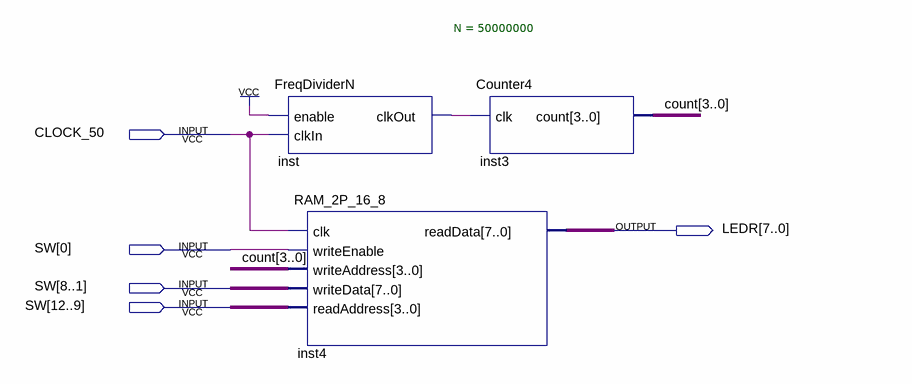
[diagram p0: schematic sheet]
// Quartus schematic RAM_2P_Demo.bdf as structural Verilog: 3 symbols, 5 pins
module RAM_2P_Demo (
  input  CLOCK_50,
  input  [12:0] SW,
  output [7:0] LEDR
);

  wire inst_clkout;
  wire [3:0] count;

  FreqDividerN #(.N(50000000)) inst (.enable(1'b1), .clkIn(CLOCK_50), .clkOut(inst_clkout));
  RAM_2P_16_8 inst4 (
    .clk(CLOCK_50), .writeEnable(SW[0]), .writeAddress(count), .writeData(SW[8:1]), .readAddress(SW[12:9]),
    .readData(LEDR));
  Counter4 inst3 (.clk(inst_clkout), .count(count));
endmodule
